# EAGLE schematic depco_ultra (EAGLE 6.1)
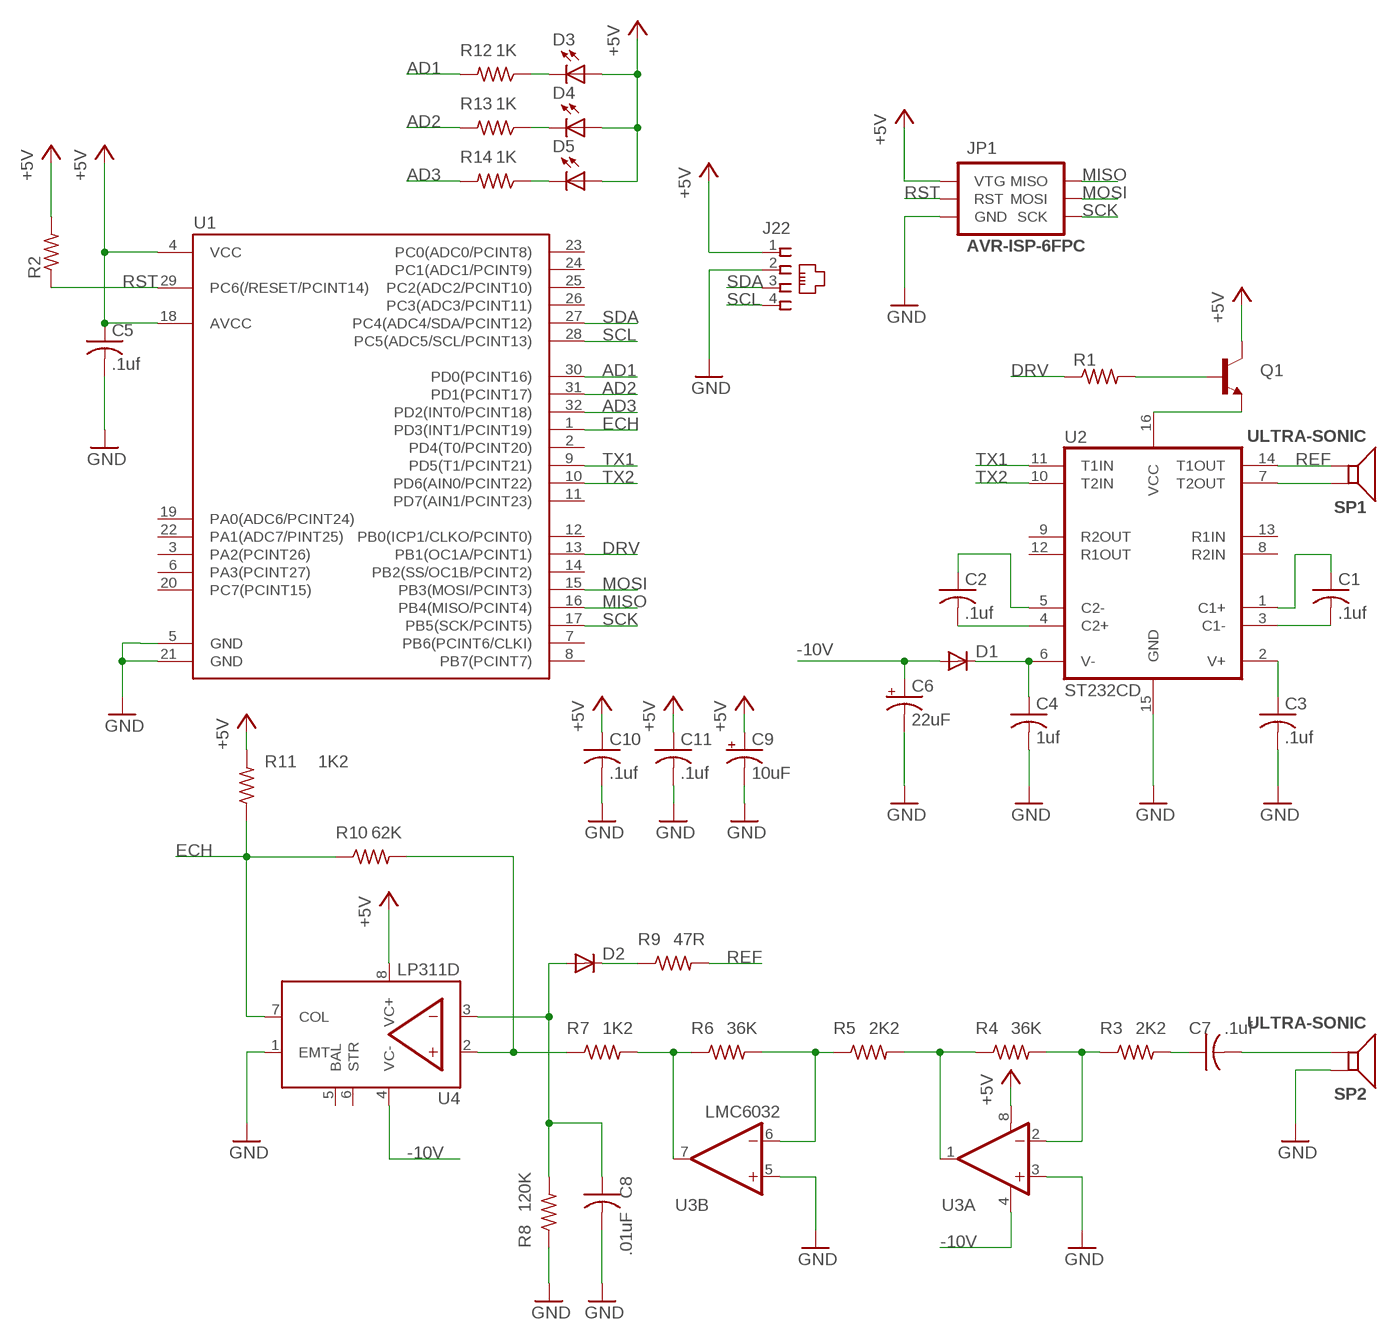
[diagram p0: schematic, sheet 1]

## Parts
C1  .1uf  C-USC0805  [C0805]
C2  .1uf  C-USC0805  [C0805]
C3  .1uf  C-USC0805  [C0805]
C4  1uf  C-USC0805  [C0805]
C5  .1uf  C-USC0805  [C0805]
C6  22uF  CPOL-USD  [PANASONIC_D]
C7  .1uf  C-USC0805  [C0805]
C8  .01uF  C-USC0805  [C0805]
C9  10uF  CPOL-USD  [PANASONIC_D]
C10  .1uf  C-USC0805  [C0805]
C11  .1uf  C-USC0805  [C0805]
D1  DIODESOD  [SOD-323]
D2  DIODESOD  [SOD-323]
D3  LED_MS  [LED-0805]
D4  LED_MS  [LED-0805]
D5  LED_MS  [LED-0805]
J22  555165-2  [555165-2]
JP1  AVR-ISP-6FPC  [84981-6]
Q1  TRANSISTOR_NPNSOT23  [SOT23]
R1  R-US_M0805  [M0805]
R2  R-US_M0805  [M0805]
R3  2K2  R-US_M0805  [M0805]
R4  36K  R-US_M0805  [M0805]
R5  2K2  R-US_M0805  [M0805]
R6  36K  R-US_M0805  [M0805]
R7  1K2  R-US_M0805  [M0805]
R8  120K  R-US_M0805  [M0805]
R9  47R  R-US_M0805  [M0805]
R10  62K  R-US_M0805  [M0805]
R11  1K2  R-US_M0805  [M0805]
R12  1K  R-US_M0805  [M0805]
R13  1K  R-US_M0805  [M0805]
R14  1K  R-US_M0805  [M0805]
SP1  ULTRA-SONIC  [400_D64INC]
SP2  ULTRA-SONIC  [400_D64INC]
U1  ATTINY48-QFN  [TQFP32-08]
U2  ST232CD  MAX232SOIC16  [SO016]
U3  LMC6032  OPAMP-DUALU  [SO08]
U4  LP311D  [SO08]

## Nets
+5V [SUPPLY]: C5.1 C9.+ C10.1 C11.1 D3.A D4.A D5.A J22.1 JP1.5(VTG) Q1.3(C) R2.2 R11.2 U1.4(VCC) U1.18(AVCC) U3.8(A:V+) U4.8(VC+)
-10V: C6.+ D1.2(A) U3.4(A:V-) U4.4(VC-)
AD1: R12.2 U1.30(PD0(PCINT16))
AD2: R13.2 U1.31(PD1(PCINT17))
AD3: R14.2 U1.32(PD2(INT0/PCINT18))
DRV: R1.1 U1.13(PB1(OC1A/PCINT1))
ECH: R10.1 R11.1 U1.1(PD3(INT1/PCINT19)) U4.7(COL)
GND [SUPPLY]: C3.2 C4.2 C5.2 C6.- C8.2 C9.- C10.2 C11.2 J22.2 JP1.6(GND) R8.1 SP2.1(P+) U1.5(GND) U1.21(GND) U2.15(GND) U3.3(A:+IN) U3.5(B:+IN) U4.1(EMT)
MISO: JP1.2(MISO) U1.16(PB4(MISO/PCINT4))
MOSI: JP1.3(MOSI) U1.15(PB3(MOSI/PCINT3))
N$1: C2.1 U2.5(C2-)
N$2: C2.2 U2.4(C2+)
N$3: C1.1 U2.1(C1+)
N$4: C1.2 U2.3(C1-)
N$5: C4.1 D1.1(C) U2.6(V-)
N$6: C3.1 U2.2(V+)
N$7: Q1.2(E) U2.16(VCC)
N$8: Q1.1(B) R1.2
N$9: D3.C R12.1
N$10: R5.1 R6.2 U3.6(B:-IN)
N$11: C7.1 R3.2
N$12: R4.1 R5.2 U3.1(A:OUT)
N$13: R3.1 R4.2 U3.2(A:-IN)
N$14: R6.1 R7.2 U3.7(B:OUT)
N$15: R7.1 R10.2 U4.2(+IN)
N$16 [SUPPLY]: SP1.1(P+) U2.7(T2OUT)
N$17: C7.2 SP2.2(P-)
N$18: C8.1 D2.2(A) R8.2 U4.3(-IN)
N$19: D4.C R13.1
N$20: D5.C R14.1
N$21: D2.1(C) R9.1
REF [SUPPLY]: R9.2 SP1.2(P-) U2.14(T1OUT)
RST: JP1.4(RST) R2.1 U1.29(PC6(/RESET/PCINT14))
SCK: JP1.1(SCK) U1.17(PB5(SCK/PCINT5))
SCL: J22.4 U1.28(PC5(ADC5/SCL/PCINT13))
SDA: J22.3 U1.27(PC4(ADC4/SDA/PCINT12))
TX1: U1.9(PD5(T1/PCINT21)) U2.11(T1IN)
TX2: U1.10(PD6(AIN0/PCINT22)) U2.10(T2IN)
Unconnected: U1.2(PD4(T0/PCINT20)) U1.3(PA2(PCINT26)) U1.7(PB6(PCINT6/CLKI)) U1.8(PB7(PCINT7)) U1.11(PD7(AIN1/PCINT23)) U1.12(PB0(ICP1/CLKO/PCINT0)) U1.14(PB2(SS/OC1B/PCINT2)) U1.19(PA0(ADC6/PCINT24)) U1.22(PA1(ADC7/PINT25)) U1.23(PC0(ADC0/PCINT8)) U1.24(PC1(ADC1/PCINT9)) U1.25(PC2(ADC2/PCINT10)) U1.26(PC3(ADC3/PCINT11)) U2.8(R2IN) U2.9(R2OUT) U2.12(R1OUT) U2.13(R1IN) U4.5(BAL) U4.6(STR)

## Power pins joined to a net without a drawn wire
PA3(PCINT27): U1.6(PA3(PCINT27))
PC7(PCINT15): U1.20(PC7(PCINT15))

## Library data of the parts
C1-C5 C7 C8 C10 C11 = rcl:C-US: CAPACITOR, American symbol
C6 C9 = rcl:CPOL-US: POLARIZED CAPACITOR, American symbol
D1 D2 = SparkFun2:DIODE: Diode These are standard reverse protection diodes and small signal diodes. SMA package can handle up to about 1A. SOD-323 can handle about 200mA. What the SOD-323 package when ordering, there are some mfgs out there that are 5-pin packages.
D3-D5 = machine_science:LED_MS
J22 = con-amp:555165-2: AMP connector
JP1 = machine_science2:AVR-ISP-6: AVR ISP-6 Serial Programming Header
Q1 = SparkFun:TRANSISTOR_NPN: Transistor NPN BJT configuration in SOT23 package. MMBT2222 is the common NPN we use. Double check BCE configuration again layout.
R1-R14 = rcl:R-US_: RESISTOR, American symbol
SP1 SP2 = machine_science2:ULTRA-SONIC
U1 = machine_science2:ATTINY48
U2 = machine_science2:MAX232: RS232 Transceiver Very common IC. This is generically called 'MAX232', but works with the 3V equivalent MAX3232 generic ICs. Field tested and mother approved. Spark Fun Electronics SKU : COM-00316 (DIP) and COM-00589 (SMD)
U3 = SparkFun2:OPAMP-DUAL: Operational Amplifier
U4 = machine_science2:LP311

## Net classes
0 SIGNAL: width 0.203 mm, drill 0.203 mm, clearance 0.203 mm
1 SUPPLY: width 0.406 mm, drill 0.305 mm, clearance 0.508 mm to class 0, clearance 0.508 mm